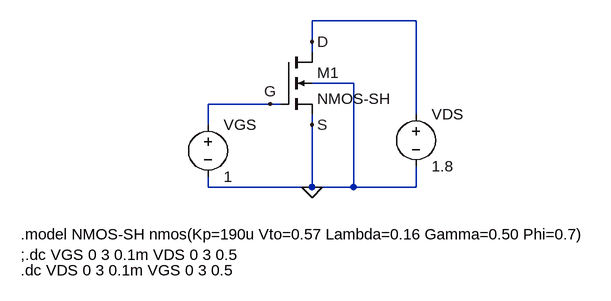
[diagram p0: schematic lab1_NMOS.asc]
lab1_NMOS.asc, the LTspice schematic file:
Version 4
SHEET 1 880 680
WIRE 544 -160 384 -160
WIRE 384 -128 384 -160
WIRE 384 -112 384 -128
WIRE 448 -64 384 -64
WIRE 320 -32 224 -32
WIRE 336 -32 320 -32
WIRE 544 -16 544 -160
WIRE 224 0 224 -32
WIRE 384 0 384 -16
WIRE 224 96 224 80
WIRE 384 96 384 0
WIRE 384 96 224 96
WIRE 448 96 448 -64
WIRE 448 96 384 96
WIRE 544 96 544 64
WIRE 544 96 448 96
FLAG 384 96 0
FLAG 384 0 S
FLAG 320 -32 G
FLAG 384 -128 D
SYMBOL voltage 224 -16 R0
WINDOW 123 0 0 Left 0
WINDOW 39 0 0 Left 0
SYMATTR InstName VGS
SYMATTR Value 1
SYMBOL voltage 544 -32 R0
WINDOW 123 0 0 Left 0
WINDOW 39 0 0 Left 0
SYMATTR InstName VDS
SYMATTR Value 1.8
SYMBOL nmos4 336 -112 R0
SYMATTR InstName M1
SYMATTR Value NMOS-SH
TEXT -64 168 Left 2 !.model NMOS-SH nmos(Kp=190u Vto=0.57 Lambda=0.16 Gamma=0.50 Phi=0.7)
TEXT -64 200 Left 2 !;.dc VGS 0 3 0.1m VDS 0 3 0.5
TEXT -64 224 Left 2 !.dc VDS 0 3 0.1m VGS 0 3 0.5

The netlist it stands for:
* lab1_NMOS.asc
VGS G 0 1
VDS D 0 1.8
M1 D G 0 0 NMOS-SH
.model NMOS NMOS
.model PMOS PMOS
.lib standard.mos
.model NMOS-SH nmos(Kp=190u Vto=0.57 Lambda=0.16 Gamma=0.50 Phi=0.7)
;.dc VGS 0 3 0.1m VDS 0 3 0.5
.dc VDS 0 3 0.1m VGS 0 3 0.5
.backanno
.end